# Altium schematic sheet PCB_28_pin_sch.SchDoc
size A2
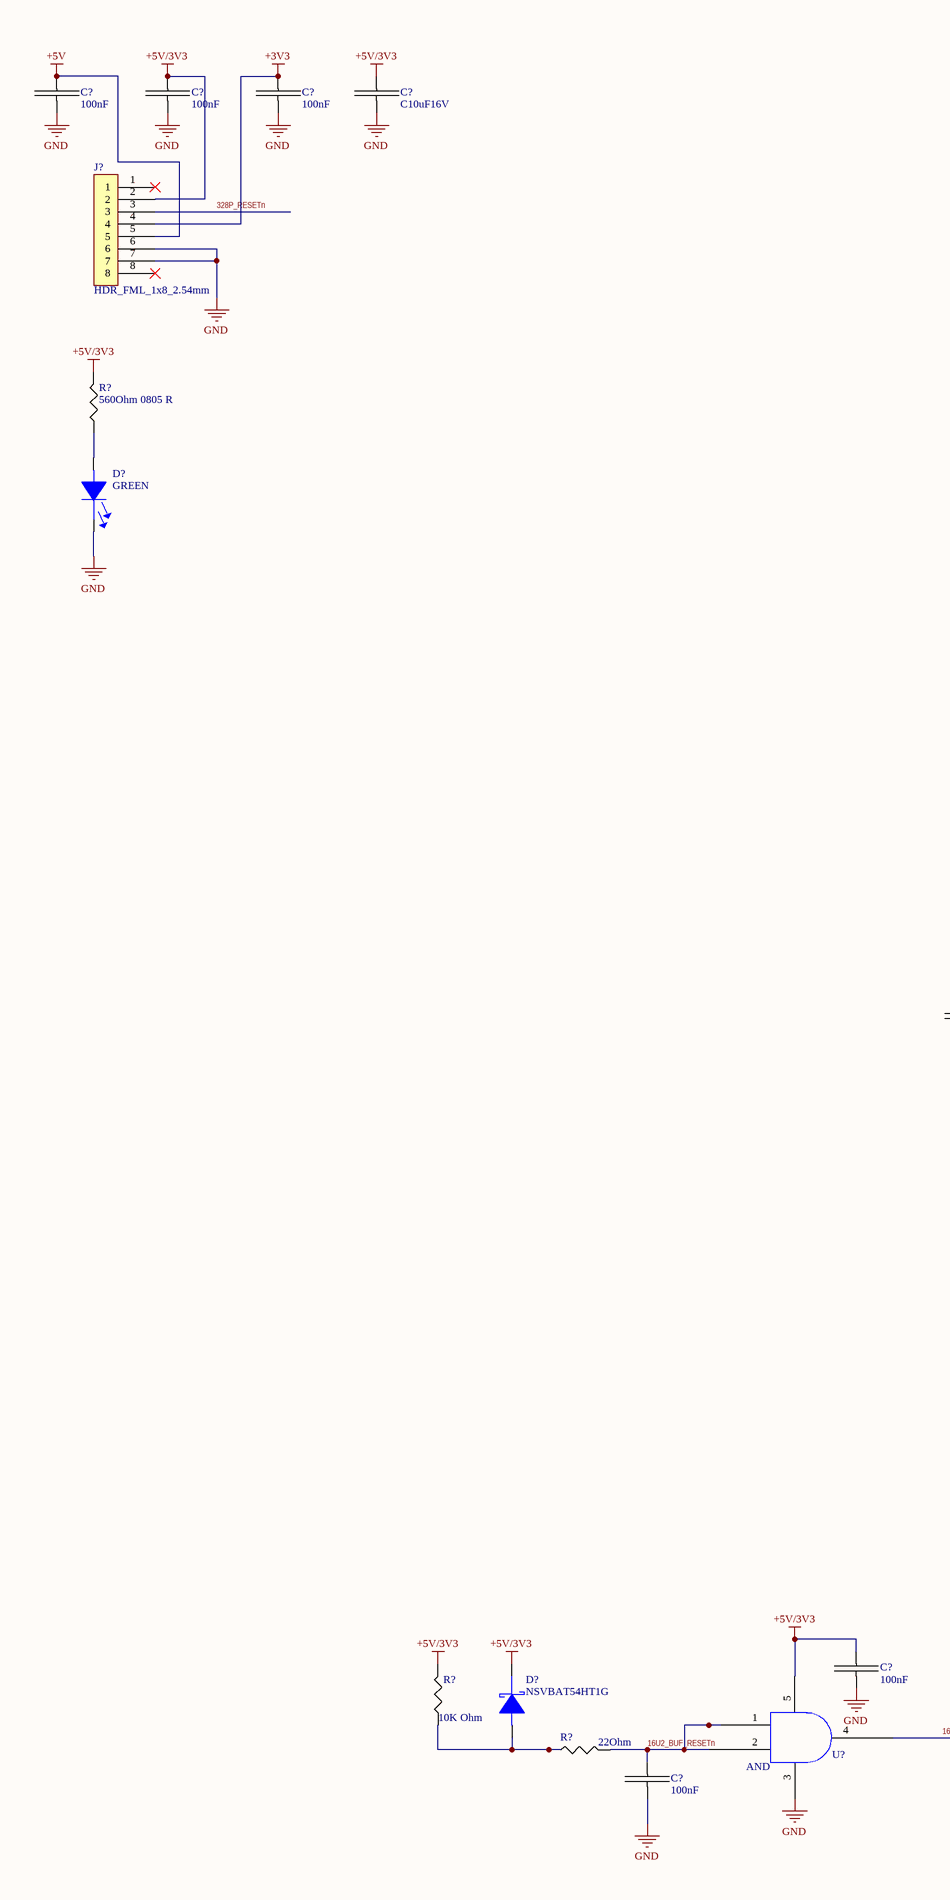
[diagram p0: PCB_28_pin_sch.SchDoc, left]
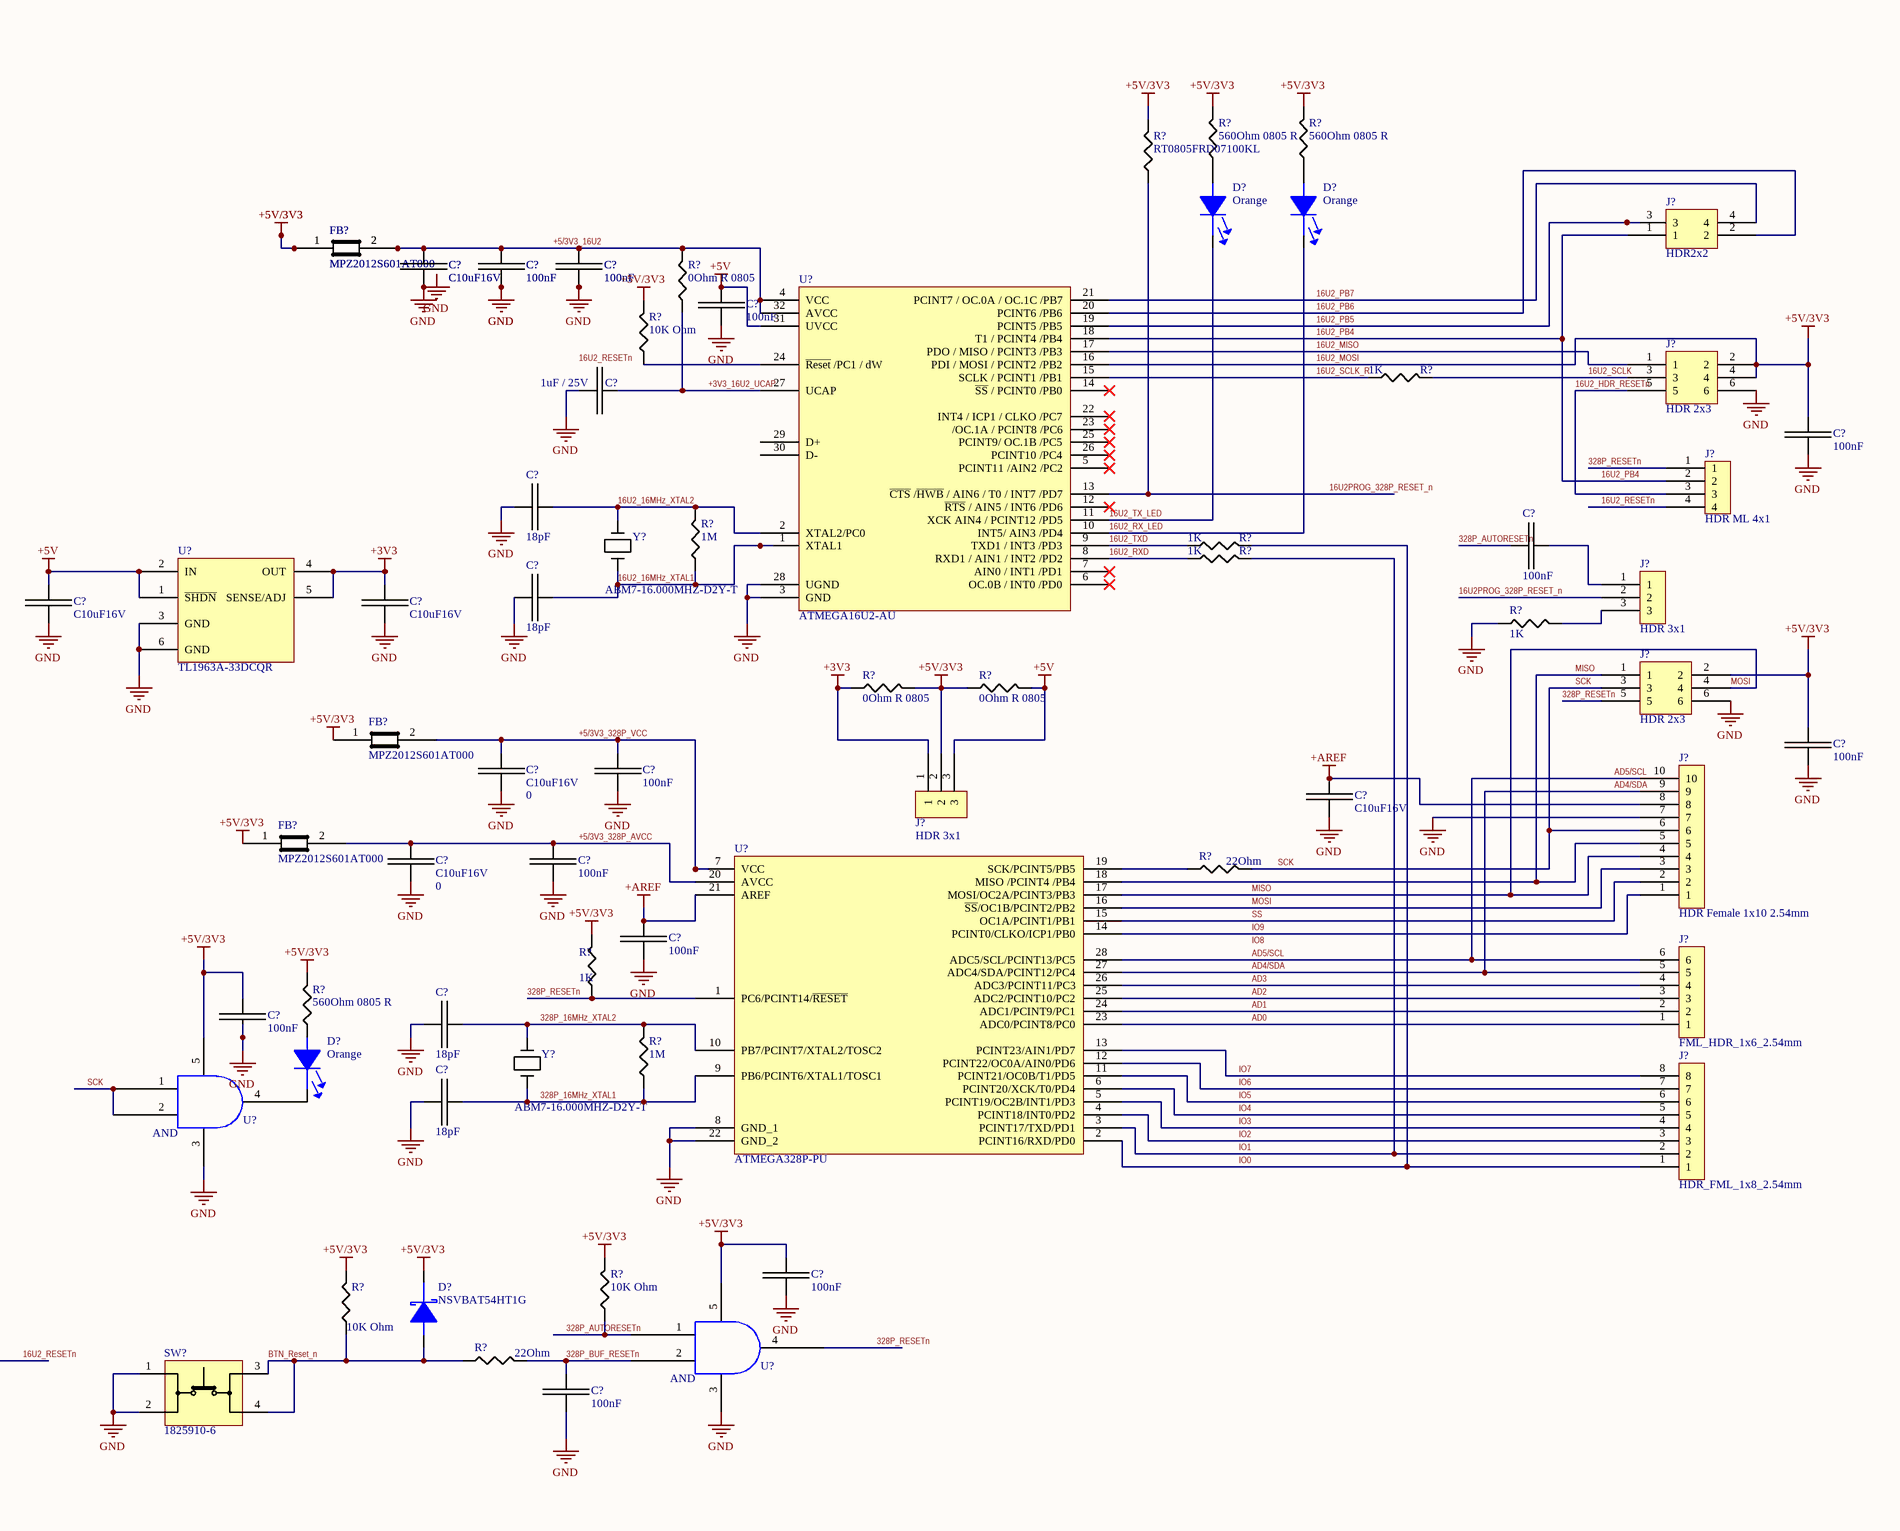
[diagram p1: PCB_28_pin_sch.SchDoc, right]

## Parts
(Parts that share a designator on the sheet are numbered #1, #2 ... from top to bottom, then left to right.)
C?#1  100nF  [C0805]
C?#2  100nF  [C0805]
C?#3  100nF  [C0805]
C?#4  C10uF16V  [C0805]
C?#5  C10uF16V  [C0805]
C?#6  C10uF16V  [C0805]
C?#7  100nF  [C0805]
C?#8  100nF  [C0805]
C?#9  100nF  [C0805]
C?#10  100nF  [C0805]
C?#11  100nF  [C0805]
C?#12  1uF / 25V  [C0805]
C?#13  100nF  [C0805]
C?#14  18pF  [C0805]
C?#15  100nF  [C0805]
C?#16  C10uF16V  [C0805]
C?#17  C10uF16V  [C0805]
C?#18  18pF  [C0805]
C?#19  100nF  [C0805]
C?#20  C10uF16V  Stock 1: 0  [C0805]
C?#21  100nF  [C0805]
C?#22  C10uF16V  [C0805]
C?#23  C10uF16V  Stock 1: 0  [C0805]
C?#24  100nF  [C0805]
C?#25  100nF  [C0805]
C?#26  100nF  [C0805]
C?#27  18pF  [C0805]
C?#28  18pF  [C0805]
C?#29  100nF  [C0805]
C?#30  100nF  [C0805]
C?#31  100nF  [C0805]
C?#32  100nF  [C0805]
D?#1  GREEN  [LED_0603]
D?#2  Orange  [LED_0603]
D?#3  Orange  [LED_0603]
D?#4  Orange  [LED_0603]
D?#5  NSVBAT54HT1G  [SOD323]
D?#6  NSVBAT54HT1G  [SOD323]
FB?#1  MPZ2012S601AT000  [C0805]
FB?#2  MPZ2012S601AT000  [C0805]
FB?#3  MPZ2012S601AT000  [C0805]
FB?#4  MPZ2012S601AT000  [C0805]
J?#1  HDR_FML_1x8_2.54mm  [HDR_FML_1x8_2.54mm]
J?#2  HDR2x2  [HDR2x22.54mm]
J?#3  HDR 2x3  [HDR2x32.54mm]
J?#4  HDR ML 4x1  [HDR_ML_1x4_2.54mm]
J?#5  HDR 3x1  [HDR_ML_1x3_2.54mm]
J?#6  HDR 2x3  [HDR2x32.54mm]
J?#7  HDR 3x1  [HDR_ML_1x3_2.54mm]
J?#8  HDR Female 1x10 2.54mm  [HDR_FML_1x10_2.54mm]
J?#9  FML_HDR_1x6_2.54mm  [HDR_FML_1x6_2.54mm]
J?#10  HDR_FML_1x8_2.54mm
R?#1  560Ohm 0805 R  [R0805]
R?#2  560Ohm 0805 R  [R0805]
R?#3  560Ohm 0805 R  [R0805]
R?#4  RT0805FRD07100KL  [R0805]
R?#5  0Ohm R 0805  [R0805]
R?#6  10K Ohm  [R0805]
R?#7  1K  [R0805]
R?#8  1M  [R0805]
R?#9  1K  [R0805]
R?#10  1K  [R0805]
R?#11  1K  [R0805]
R?#12  0Ohm R 0805  [R0805]
R?#13  0Ohm R 0805  [R0805]
R?#14  22Ohm  [R0805]
R?#15  1K  [R0805]
R?#16  560Ohm 0805 R  [R0805]
R?#17  1M  [R0805]
R?#18  10K Ohm  [R0805]
R?#19  10K Ohm  [R0805]
R?#20  10K Ohm  [R0805]
R?#21  22Ohm  [R0805]
R?#22  22Ohm  [R0805]
SW?  1825910-6  [1825910-6]
U?#1  ATMEGA16U2-AU  [TQFP32]
U?#2  TL1963A-33DCQR  [DCQ (R-PDSO-G6)]
U?#3  ATMEGA328P-PU  [DIP28_7.62]
U?#4  SN74AHC1G09DBVR  [DBV_SOP23_5]  (value not drawn)
U?#5  SN74AHC1G09DBVR  [DBV_SOP23_5]  (value not drawn)
U?#6  SN74AHC1G09DBVR  [DBV_SOP23_5]  (value not drawn)
Y?#1  ABM7-16.000MHZ-D2Y-T  [ABM7_v1_1_BIG]
Y?#2  ABM7-16.000MHZ-D2Y-T  [ABM7_v1_1_BIG]

## Nets
16U2_MOSI: C?#2.2 C?#4.2 C?#13.2 C?#19.2 C?#26.2 C?#29.2 C?#30.2 D?#5.1(Cathode) D?#6.1(Cathode) FB?#1.1 FB?#2.1 FB?#3.1 FB?#4.1 J?#1.2 J?#3.2 J?#3.4 J?#6.2 J?#7.2 R?#1.2 R?#2.2 R?#3.2 R?#4.2 R?#6.2 R?#12.2 R?#13.1 R?#15.2 R?#16.2 R?#18.2 R?#19.2 R?#20.2 U?#1.16(PDI_/_MOSI_/_PCINT2_/PB2) U?#4.5 U?#5.5 U?#6.5  [also labelled +5V/3V3]
+3V3: C?#3.2 C?#17.2 J?#1.4 J?#7.1 R?#12.1 U?#2.4(OUT) U?#2.5(SENSE/ADJ)
+5V: C?#1.2 C?#11.2 C?#16.2 J?#1.5 J?#7.3 R?#13.2 U?#1.31(UVCC) U?#2.1(~{SHDN}) U?#2.2(IN)
+AREF: C?#22.2 C?#25.2 J?#8.8 U?#3.21(AREF)
GND: C?#1.1 C?#2.1 C?#3.1 C?#4.1 C?#5.1 C?#6.1 C?#7.1 C?#8.1 C?#9.1 C?#10.1 C?#11.1 C?#12.1 C?#13.1 C?#14.1 C?#16.1 C?#17.1 C?#18.1 C?#19.1 C?#20.1 C?#21.1 C?#22.1 C?#23.1 C?#24.1 C?#25.1 C?#26.1 C?#27.1 C?#28.1 C?#29.1 C?#30.1 C?#31.1 C?#32.1 D?#1.1(Cathode) J?#1.6 J?#1.7 J?#3.6 J?#6.6 J?#8.7 R?#11.1 SW?.1 SW?.2 U?#1.3(GND) U?#1.28(UGND) U?#2.3(GND) U?#2.6(GND) U?#3.8(GND_1) U?#3.22(GND_2) U?#4.3 U?#5.3 U?#6.3
16U2_16MHz_XTAL1: C?#18.2 R?#8.1 U?#1.1(XTAL1) Y?#1.1
16U2_16MHz_XTAL2: C?#14.2 R?#8.2 U?#1.2(XTAL2/PC0) Y?#1.2
16U2_BUF_RESETn: C?#32.2 R?#22.2 U?#6.1 U?#6.2
16U2_HDR_RESETn: J?#3.5 J?#4.3
16U2_MISO: J?#3.1 U?#1.17(PDO_/_MISO_/_PCINT3_/PB3)
16U2_PB4: J?#2.1 J?#4.2 U?#1.18(T1_/_PCINT4_/PB4)
16U2_PB5: J?#2.3 U?#1.19(PCINT5_/PB5)
16U2_PB6: J?#2.2 U?#1.20(PCINT6_/PB6)
16U2_PB7: J?#2.4 U?#1.21(PCINT7_/_OC.0A_/_OC.1C_/PB7)
16U2_RESETn: J?#4.4 U?#6.4
16U2_RX_LED: D?#3.1(Cathode) U?#1.10(INT5/_AIN3_/PD4)
16U2_RXD: R?#10.1 U?#1.8(RXD1_/_AIN1_/_INT2_/PD2)
16U2_SCLK: J?#3.3 R?#7.2
16U2_SCLK_R: R?#7.1 U?#1.15(SCLK_/_PCINT1_/PB1)
16U2_TX_LED: D?#2.1(Cathode) U?#1.11(XCK_AIN4_/_PCINT12_/PD5)
16U2_TXD: R?#9.1 U?#1.9(TXD1_/_INT3_/PD3)
16U2PROG_328P_RESET_n: J?#5.2 R?#4.1 U?#1.13(~{CTS}_/~{HWB}_/_AIN6_/_T0_/_INT7_/PD7)
328P_16MHz_XTAL1: C?#28.2 R?#17.1 U?#3.9(PB6/PCINT6/XTAL1/TOSC1) Y?#2.1
328P_16MHz_XTAL2: C?#27.2 R?#17.2 U?#3.10(PB7/PCINT7/XTAL2/TOSC2) Y?#2.2
328P_AUTORESETn: C?#15.1 R?#18.1 U?#5.1
328P_BUF_RESETn: C?#31.2 R?#21.2 U?#5.2
328P_RESETn: J?#1.3 J?#4.1 J?#6.5 R?#15.1 U?#3.1(PC6/PCINT14/~{RESET}) U?#5.4
+3V3_16U2_UCAP: C?#12.2 R?#5.1 U?#1.27(UCAP)
+5/3V3_16U2: C?#5.2 C?#6.2 C?#7.2 C?#8.2 C?#9.2 C?#10.2 FB?#1.2 FB?#2.2 R?#5.2 U?#1.4(VCC) U?#1.32(AVCC)
+5/3V3_328P_AVCC: C?#23.2 C?#24.2 FB?#4.2 U?#3.20(AVCC)
+5/3V3_328P_VCC: C?#20.2 C?#21.2 FB?#3.2 U?#3.7(VCC)
AD0: J?#9.1 U?#3.23(ADC0/PCINT8/PC0)
AD1: J?#9.2 U?#3.24(ADC1/PCINT9/PC1)
AD2: J?#9.3 U?#3.25(ADC2/PCINT10/PC2)
AD3: J?#9.4 U?#3.26(ADC3/PCINT11/PC3)
AD4/SDA: J?#8.9 J?#9.5 U?#3.27(ADC4/SDA/PCINT12/PC4)
AD5/SCL: J?#8.10 J?#9.6 U?#3.28(ADC5/SCL/PCINT13/PC5)
BTN_Reset_n: D?#5.2(Anode) R?#19.1 R?#21.1 SW?.3 SW?.4
IO0: J?#10.1 R?#9.2 U?#3.2(PCINT16/RXD/PD0)
IO1: J?#10.2 R?#10.2 U?#3.3(PCINT17/TXD/PD1)
IO2: J?#10.3 U?#3.4(PCINT18/INT0/PD2)
IO3: J?#10.4 U?#3.5(PCINT19/OC2B/INT1/PD3)
IO4: J?#10.5 U?#3.6(PCINT20/XCK/T0/PD4)
IO5: J?#10.6 U?#3.11(PCINT21/OC0B/T1/PD5)
IO6: J?#10.7 U?#3.12(PCINT22/OC0A/AIN0/PD6)
IO7: J?#10.8 U?#3.13(PCINT23/AIN1/PD7)
IO9: J?#8.1 U?#3.14(PCINT0/CLKO/ICP1/PB0)
MISO: J?#6.1 J?#6.4 J?#8.3 J?#8.4 J?#8.5 U?#3.16(~{SS}/OC1B/PCINT2/PB2) U?#3.17(MOSI/OC2A/PCINT3/PB3) U?#3.18(MISO_/PCINT4_/PB4)  [also labelled MOSI]
SCK: J?#6.3 J?#8.6 R?#14.2 U?#4.1 U?#4.2
SS: J?#8.2 U?#3.15(OC1A/PCINT1/PB1)
NetC?#15_2: C?#15.2 J?#5.1
NetD?#1_2: D?#1.2(Anode) R?#1.1
NetD?#2_2: D?#2.2(Anode) R?#2.1
NetD?#3_2: D?#3.2(Anode) R?#3.1
NetD?#4_1: D?#4.1(Cathode) U?#4.4
NetD?#6_2: D?#6.2(Anode) R?#20.1 R?#22.1
NetJ?#5_3: J?#5.3 R?#11.2
NetR?#6_1: R?#6.1 U?#1.24(~{Reset}_/PC1_/_dW)
NetR?#14_1: R?#14.1 U?#3.19(SCK/PCINT5/PB5)

Not connected (* = marked no-connect by the designer): D?#4 2(Anode); J?#1 1* 8*; R?#16 1; U?#1 5(PCINT11_/AIN2_/PC2)* 6(OC.0B_/_INT0_/PD0)* 7(AIN0_/_INT1_/PD1)* 12(~{RTS}_/_AIN5_/_INT6_/PD6)* 14(~{SS}_/_PCINT0_/PB0)* 22(INT4_/_ICP1_/_CLKO_/PC7)* 23(/OC.1A_/_PCINT8_/PC6)* 25(PCINT9/_OC.1B_/PC5)* 26(PCINT10_/PC4)* 29(D+) 30(D-)

## Notes on the sheet
- Labels drawn without touching a wire or pin: 16U2_RESETn, GND, IO8
- (in symbol SN74AHC1G09DBVR) AND

## Library data of the parts
C?#1-C?#3 C?#7-C?#11 C?#13 C?#15 C?#19 C?#21 C?#24-C?#26 C?#29-C?#32 = C2012X7R1H104M085AA: CAP CER 0.1UF 50V X7R 0805; Manufacturer: TDK; PCN Part Number: MLCC Part Number Change 30/Nov/2012; Product Training Modules: C Series General Applications SEAT, CCV, and TVCL Design Tools Guide to Replacing an Electrolytic Capacitor with an MLCC; Capacitance: 0.1µF; Tolerance: ±20%; Online Catalog: C Series, General Purpose; Other Names: 445-7535-6; Supplier 1: Digi-Key; Manufacturer Part Number: C2012X7R1H104M085AA; Stock 1: 7928; Pricing 1: 1=0.15, 10=0.104, 50=0.059, 100=0.0488, 500=0.0342, 1000=0.0283 (USD); RoHS Information: RoHS Certificate-MLCC; Standard Package: 1; Category: Capacitors; Family: Ceramic Capacitors; Series: C; Packaging: Digi-Reel®; Voltage - Rated: 50V; Temperature Coefficient: X7R; Mounting Type: Surface Mount, MLCC; Operating Temperature: -55°C ~ 125°C; Applications: General Purpose; Ratings: -; Package / Case: 0805 (2012 Metric); Size / Dimension: 0.079" L x 0.049" W (2.00mm x 1.25mm); Height - Seated (Max): -; Thickness (Max): 0.037" (0.95mm); Lead Spacing: -; Features: -; Lead Style: -; ComponentLink1URL: https://product.tdk.com/info/en/catalog/datasheets/mlcc_commercial_general_en.pdf?src-supplier=Digi-Key; ComponentLink1Description: https://product.tdk.com/info/en/catalog/datasheets/mlcc_commercial_general_en.pdf?src-supplier=Digi-Key; ComponentLink2URL: https://product.tdk.com/info/en/catalog/spec/mlccspec_commercial_general_midvoltage_en.pdf?src-supplier=Digi-Key; ComponentLink2Description: https://product.tdk.com/info/en/catalog/spec/mlccspec_commercial_general_midvoltage_en.pdf?src-supplier=Digi-Key; Supplier Part Number 1: 445-7535-1-ND
C?#4-C?#6 C?#16 C?#17 C?#20 C?#22 C?#23 = C2012X5R1C106M125AC: CERAMIC CAPACITOR, 10UF, 16V, X5R, 20%, 0805, FULL REEL; Product Range:C Series; Capacitance:10 F; Capacitance Tolerance: 20%; Dielectric Characteristic:X5R; Voltage Rating:16V; Ceramic Capacitor Case:0805 [2012 Metric]; MSL:- ;RoHS Compliant: Yes; Manufacturer: TDK; PCN Part Number: MLCC Part Number Change 30/Nov/2012; Product Training Modules: C Series General Applications SEAT, CCV, and TVCL Design Tools Guide to Replacing an Electrolytic Capacitor with an MLCC; Catalog Drawings: C SERIES_2012-0805_1.45; Capacitance: 10µF; Online Catalog: C Series, General Purpose; Other Names: 445-4115-2 C2012X5R1C106M C2012X5R1C106M/1.25 C2012X5R1C106MT C2012X5R1C106MTJ00E; Supplier 1: Digi-Key; Manufacturer Part Number: C2012X5R1C106M125AC; RoHS Information: RoHS Certificate-MLCC; Standard Package: 2,000; Category: Capacitors; Family: Ceramic Capacitors; Series: C; Packaging: Tape & Reel (TR); Tolerance: ±20%; Voltage - Rated: 16V; Temperature Coefficient: X5R; Mounting Type: Surface Mount, MLCC; Operating Temperature: -55°C ~ 85°C; Applications: General Purpose; Ratings: -; Package / Case: 0805 (2012 Metric); Size / Dimension: 0.079" L x 0.049" W (2.00mm x 1.25mm); Height - Seated (Max): -; Thickness (Max): 0.057" (1.45mm); Lead Spacing: -; Features: -; Lead Style: -; ComponentLink1URL: https://media.digikey.com/pdf/Data%20Sheets/TDK%20PDFs/Multilayer%20Ceramic%20Chip%20Cap(up%20to%2050V).pdf?src-supplier=Digi-Key; ComponentLink1Description: https://media.digikey.com/pdf/Data%20Sheets/TDK%20PDFs/Multilayer%20Ceramic%20Chip%20Cap(up%20to%2050V).pdf?src-supplier=Digi-Key; ComponentLink2URL: http://www.farnell.com/datasheets/1913358.pdf?src-supplier=Element14; ComponentLink2Description: http://www.farnell.com/datasheets/1913358.pdf?src-supplier=Element14; ComponentLink3URL: https://product.tdk.com/info/en/documents/chara_sheet/C2012X5R1C106M125AC.pdf?src-supplier=Newark; ComponentLink3Description: https://product.tdk.com/info/en/documents/chara_sheet/C2012X5R1C106M125AC.pdf?src-supplier=Newark; Supplier Part Number 1: 445-4115-2-ND
C?#12 = C2012JB1E105M125AA: CAP CER 1UF 25V JB 0805; Manufacturer: TDK; Product Training Modules: C Series General Applications SEAT, CCV, and TVCL Design Tools Guide to Replacing an Electrolytic Capacitor with an MLCC; Featured Product: CH and JB Temperature Coefficient Capacitors; EDA / CAD Models: Download from Accelerated Designs; Capacitance: 1µF; Tolerance: ±20%; Online Catalog: C Series, General Purpose; Other Names: 445-11461-1; Supplier 1: Digi-Key; Manufacturer Part Number: C2012JB1E105M125AA; Stock 1: 1428; Pricing 1: 1=0.2, 10=0.139, 50=0.0836, 100=0.0706, 500=0.0483, 1000=0.0428 (USD); RoHS Information: RoHS Certificate-MLCC; Standard Package: 1; Category: Capacitors; Family: Ceramic Capacitors; Series: C; Packaging: Cut Tape (CT); Voltage - Rated: 25V; Temperature Coefficient: JB; Mounting Type: Surface Mount, MLCC; Operating Temperature: -25°C ~ 85°C; Applications: General Purpose; Package / Case: 0805 (2012 Metric); Size / Dimension: 0.079" L x 0.049" W (2.00mm x 1.25mm); Thickness (Max): 0.057" (1.45mm); ComponentLink1URL: https://product.tdk.com/en/products/common/pdf/mlcc_partnumber_description.pdf?src-supplier=Digi-Key; ComponentLink1Description: https://product.tdk.com/en/products/common/pdf/mlcc_partnumber_description.pdf?src-supplier=Digi-Key; Supplier Part Number 1: 445-11461-1-ND
C?#14 C?#18 C?#27 C?#28 = C0805C180J5GACTU: CAP CER 18PF 16V; Manufacturer: KEMET; Product Depth: 1.25 mm; Product Height: 0.78 mm; Product Length: 2 mm; Dielectric: C0G; Tolerance: 5 %; Voltage: 50 Vdc; Supplier 1: Digi-Key; Manufacturer Part Number: C0805C180J5GACTU; Stock 1: 98426; Pricing 1: 1=0.12, 10=0.086, 50=0.049, 100=0.0407, 500=0.0285, 1000=0.0236 (USD); Category: Capacitor Ceramic Multilayer; Construction: Flat; Operating Temperature: -55 to 125 °C; Capacitance Value: 18 pF; Mounting: Surface Mount; Package/Case: 0805; ComponentLink1URL: http://www.farnell.com/datasheets/1769375.pdf?src-supplier=Element14; ComponentLink1Description: http://www.farnell.com/datasheets/1769375.pdf?src-supplier=Element14; ComponentLink2URL: https://www.verical.com/server-webapp/html/getDatasheet?partID=385668&src-supplier=Verical; ComponentLink2Description: https://www.verical.com/server-webapp/html/getDatasheet?partID=385668&src-supplier=Verical; ComponentLink3URL: https://www.verical.com/server-webapp/html/getDatasheet?partID=759702&src-supplier=Verical; ComponentLink3Description: https://www.verical.com/server-webapp/html/getDatasheet?partID=759702&src-supplier=Verical; Supplier Part Number 1: 399-1112-1-ND
D?#1 = LGL29K-G2J1-24-Z: LED 0603 GREEN; Manufacturer: Osram Opto; Categories: Optoelectronics; Configuration: Standard; Lens Color: White; Lens Transparency: Diffused; Millicandela Rating: 3.92mcd; Lens Style: Rectangle with Flat Top; Lens Size: 1.30mm x 0.80mm; Voltage - Forward (Vf) (Typ): 1.7V; Current - Test: 2mA; Viewing Angle: 160°; Wavelength - Dominant: 570nm; Wavelength - Peak: 572nm; Supplier 1: Digi-Key; Manufacturer Part Number: LGL29K-G2J1-24-Z; Stock 1: 196415; Pricing 1: 1=0.47, 10=0.31, 100=0.2071, 500=0.1432, 1000=0.1194, 2000=0.1074 (USD); Series: SmartLED; Packaging: Digi-Reel®; Part Status: Active; Color: Green; Mounting Type: Surface Mount; Features: -; Package / Case: 0603 (1608 Metric); Supplier Device Package: 0603; Size / Dimension: 1.70mm L x 0.80mm W; Height (Max): 0.65mm; ComponentLink1URL: https://dammedia.osram.info/media/resource/hires/osram-dam-2493945/LG%20L29K.pdf?src-supplier=Digi-Key; ComponentLink1Description: https://dammedia.osram.info/media/resource/hires/osram-dam-2493945/LG%20L29K.pdf?src-supplier=Digi-Key; ComponentLink2URL: http://www.mouser.com/ds/2/311/LG%20L29K%20-%20SMARTLED%200603-335234.pdf?src-supplier=Mouser; ComponentLink2Description: http://www.mouser.com/ds/2/311/LG%20L29K%20-%20SMARTLED%200603-335234.pdf?src-supplier=Mouser; ComponentLink3URL: https://www.verical.com/server-webapp/html/getDatasheet?partID=571127&src-supplier=Verical; ComponentLink3Description: https://www.verical.com/server-webapp/html/getDatasheet?partID=571127&src-supplier=Verical; Supplier Part Number 1: 475-2709-1-ND
D?#2-D?#4 = LOL29K-H2K1-24-Z: SMARTLED 0603 ORANGE; Manufacturer: Osram Opto; Categories: Optoelectronics; Configuration: Standard; Lens Color: White; Lens Transparency: Diffused; Millicandela Rating: 6.3mcd; Lens Style: Rectangle with Flat Top; Lens Size: 1.30mm x 0.80mm; Voltage - Forward (Vf) (Typ): 1.8V; Current - Test: 2mA; Viewing Angle: 160°; Wavelength - Dominant: 606nm; Wavelength - Peak: 610nm; Supplier 1: Digi-Key; Manufacturer Part Number: LOL29K-H2K1-24-Z; Stock 1: 0; Series: SmartLED; Packaging: Digi-Reel®; Part Status: Active; Color: Orange; Mounting Type: Surface Mount; Features: -; Package / Case: 0603 (1608 Metric); Supplier Device Package: 0603; Size / Dimension: 1.70mm L x 0.80mm W; Height (Max): 0.65mm; ComponentLink1URL: https://dammedia.osram.info/media/resource/hires/osram-dam-2493882/LO%20L29K.pdf?src-supplier=Digi-Key; ComponentLink1Description: https://dammedia.osram.info/media/resource/hires/osram-dam-2493882/LO%20L29K.pdf?src-supplier=Digi-Key; ComponentLink2URL: https://www.verical.com/server-webapp/html/getDatasheet?partID=693885&src-supplier=Verical; ComponentLink2Description: https://www.verical.com/server-webapp/html/getDatasheet?partID=693885&src-supplier=Verical; Supplier Part Number 1: 475-2740-1-ND
D?#5 D?#6 = NSVBAT54HT1G: Schottky Diodes & Rectifiers SS SCHOTTKY DIODE; Manufacturer: ON Semiconductor; Voltage - DC Reverse (Vr) (Max): 30V; Current - Average Rectified (Io): 200mA (DC); Voltage - Forward (Vf) (Max) @ If: 800mV @ 100mA; Speed: Small Signal =; Reverse Recovery Time (trr): 5ns; Current - Reverse Leakage @ Vr: 2µA @ 25V; Capacitance @ Vr, F: 10pF @ 1V, 1MHz; Supplier 1: Digi-Key; Manufacturer Part Number: NSVBAT54HT1G; Stock 1: 5789; Pricing 1: 1=0.51, 10=0.362, 100=0.1826, 500=0.1618, 1000=0.1259 (USD); Standard Package: 3,000; Category: Discrete Semiconductor Products; Family: Diodes, Rectifiers - Single; Diode Type: Schottky; Mounting Type: Surface Mount; Package / Case: SC-76, SOD-323; Supplier Device Package: SOD-323; Packaging: Tape & Reel (TR); ComponentLink1URL: http://www.onsemi.com/pub/Collateral/BAT54HT1-D.PDF?src-supplier=Digi-Key; ComponentLink1Description: http://www.onsemi.com/pub/Collateral/BAT54HT1-D.PDF?src-supplier=Digi-Key; ComponentLink2URL: http://www.onsemi.com/pub_link/Collateral/BAT54HT1-D.PDF?src-supplier=Avnet+Europe; ComponentLink2Description: http://www.onsemi.com/pub_link/Collateral/BAT54HT1-D.PDF?src-supplier=Avnet+Europe; Supplier Part Number 1: NSVBAT54HT1GOSCT-ND
FB?#1-FB?#4 = MPZ2012S601AT000: FERRITE BEAD 600 OHM 0805 1LN; Manufacturer: TDK; PCN Part Number: MMZ,MPS Series Oct/2014; Product Training Modules: EMC Components; Catalog Drawings: (MMZ,MPZ)2012 Series Top / (MMZ,MPZ)2012 Series Footprint / (MMZ,MPZ)2012 Series Side; Impedance @ Frequency: 600 Ohm @ 100MHz; Current Rating: 2A; DC Resistance (DCR): 100 mOhm Max; Filter Type: Differential Mode - Single; Online Catalog: MPZ2012 Series; Other Names: 445-2206-6; Supplier 1: Digi-Key; Manufacturer Part Number: MPZ2012S601AT000; Stock 1: 215439; Pricing 1: 1=0.11, 10=0.092, 25=0.0824, 50=0.0604, 100=0.0522, 250=0.0412, 500=0.0348, 1000=0.0293 (USD); Standard Package: 1; Category: Filters; Family: Ferrite Beads and Chips; Series: MPZ; Packaging: Digi-Reel®; Package / Case: 0805 (2012 Metric); Mounting Type: Surface Mount; Height (Max): 0.041" (1.05mm); Size / Dimension: 0.079" L x 0.049" W (2.00mm x 1.25mm); ComponentLink1URL: https://media.digikey.com/pdf/Data%20Sheets/TDK%20PDFs/MPZ_Series_Br.pdf?src-supplier=Digi-Key; ComponentLink1Description: https://media.digikey.com/pdf/Data%20Sheets/TDK%20PDFs/MPZ_Series_Br.pdf?src-supplier=Digi-Key; ComponentLink2URL: https://product.tdk.com/info/en/catalog/datasheets/beads_commercial_power_mpz2012_en.pdf?src-supplier=Digi-Key; ComponentLink2Description: https://product.tdk.com/info/en/catalog/datasheets/beads_commercial_power_mpz2012_en.pdf?src-supplier=Digi-Key; Supplier Part Number 1: 445-2206-1-ND
J?#1 J?#10 = M20-7820842: 2.54mm (0.1") Pitch SIL Vertical PC Tail Socket Assembly, selective gold + tin, 8 contacts; Manufacturer: Harwin; Rad Hard: No; Number of Contacts: 8; Gender: SKT; Supplier 1: Digi-Key; Manufacturer Part Number: M20-7820842; Stock 1: 384; Pricing 1: 1=1.17, 10=1.03, 100=0.8888, 500=0.7272, 1000=0.6464, 5000=0.5656, 10000=0.5373 (USD); Type: Socket Strip; Pitch: 2.54 mm; Number of Rows: 1; Contact Plating: Gold; Termination Method: Solder; Category: Connector Headers and PCB Receptacles; ComponentLink1URL: https://cdn.harwin.com/pdfs/Harwin_PC_Connectors_M20.pdf?src-supplier=Avnet+Europe; ComponentLink1Description: https://cdn.harwin.com/pdfs/Harwin_PC_Connectors_M20.pdf?src-supplier=Avnet+Europe; ComponentLink2URL: http://www.harwin.com/include/downloads/drawings/M20-782.PDF?src-supplier=Avnet; ComponentLink2Description: http://www.harwin.com/include/downloads/drawings/M20-782.PDF?src-supplier=Avnet; Supplier Part Number 1: 952-1823-ND
J?#2 = 67996-404HLF: 67996-404HLF-BERG II 100CC DR ST ;ROHS COMPLIANT: YES; Manufacturer: Amphenol FCI; Pitch: 2.54 mm; Number of Contacts: 4; Gender: HDR; Supplier 1: Digi-Key; Manufacturer Part Number: 67996-404HLF; Stock 1: 2263; Pricing 1: 1=0.25, 10=0.235, 100=0.163, 500=0.1379, 1000=0.1129, 5000=0.1003, 10000=0.0909 (USD); Type: Unshrouded Header; Number of Rows: 2; Contact Plating: Tin Over Nickel; Termination Method: Solder; Category: Connector Headers and PCB Receptacles; ComponentLink1URL: https://cdn.amphenol-icc.com/media/wysiwyg/files/drawing/67996.pdf?src-supplier=Digi-Key; ComponentLink1Description: https://cdn.amphenol-icc.com/media/wysiwyg/files/drawing/67996.pdf?src-supplier=Digi-Key; ComponentLink2URL: http://portal.fciconnect.com/Comergent/fci/drawing/67996.pdf?src-supplier=Avnet; ComponentLink2Description: http://portal.fciconnect.com/Comergent/fci/drawing/67996.pdf?src-supplier=Avnet; ComponentLink3URL: http://portal.fciconnect.com/Comergent/fci/drawing/67996.pdf?src-supplier=Avnet+Europe; ComponentLink3Description: http://portal.fciconnect.com/Comergent/fci/drawing/67996.pdf?src-supplier=Avnet+Europe; Supplier Part Number 1: 609-3390-ND
J?#3 J?#6 = 68602-206HLF: AMPHENOL FCI   68602-206HLF   BOARD TO BOARD, HEADER, 6 POSITION, 2ROW; Pitch Spacing: 2.54mm; No. of Rows: 2; No. of Contacts: 6; Contact Termination: Through Hole Vertical; Supplier 1: Digi-Key; Manufacturer: Amphenol FCI; Manufacturer Part Number: 68602-206HLF; Stock 1: 3941; Pricing 1: 1=0.47, 10=0.442, 100=0.3386, 500=0.2944, 1000=0.2429, 5000=0.2134, 10000=0.1987 (USD); Series: BergStik; Gender: Header; Contact Plating: Gold; Contact Material: Phosphor Bronze; ComponentLink1URL: http://www.farnell.com/datasheets/1876884.pdf?src-supplier=Element14; ComponentLink1Description: http://www.farnell.com/datasheets/1876884.pdf?src-supplier=Element14; ComponentLink2URL: http://portal.fciconnect.com/Comergent//fci/drawing/67996.pdf?src-supplier=Digi-Key; ComponentLink2Description: http://portal.fciconnect.com/Comergent//fci/drawing/67996.pdf?src-supplier=Digi-Key; ComponentLink3URL: http://portal.fciconnect.com/Comergent/fci/drawing/67996.pdf?src-supplier=Avnet; ComponentLink3Description: http://portal.fciconnect.com/Comergent/fci/drawing/67996.pdf?src-supplier=Avnet
J?#4 = 61300411121: HEADER VERT 4POS 2.54MM; Manufacturer: Wurth Electronics; Connector Type: Header, Unshrouded; Number of Positions: 4; Number of Positions Loaded: All; Pitch: 0.100" (2.54mm); Supplier 1: Digi-Key; Manufacturer Part Number: 61300411121; Stock 1: 39006; Pricing 1: 1=0.18, 10=0.153, 25=0.1272, 50=0.106, 100=0.096, 1000=0.088 (USD); Category: Connectors, Interconnects; Family: Rectangular Connectors - Headers, Male Pins; Series: WR-PHD; Packaging: Bulk; Contact Type: Male Pin; Number of Rows: 1; Row Spacing: -; Contact Mating Length: 0.236" (6.00mm); Mounting Type: Through Hole; Termination: Solder; Fastening Type: -; Features: -; Contact Finish: Gold; Contact Finish Thickness: -; Color: Black; ComponentLink1URL: http://www.farnell.com/cad/1737268.pdf?src-supplier=Element14; ComponentLink1Description: http://www.farnell.com/cad/1737268.pdf?src-supplier=Element14; ComponentLink2URL: https://katalog.we-online.de/em/datasheet/6130xx11121.pdf?src-supplier=Digi-Key; ComponentLink2Description: https://katalog.we-online.de/em/datasheet/6130xx11121.pdf?src-supplier=Digi-Key; Supplier Part Number 1: 732-5317-ND
J?#5 J?#7 = 75160-150-03LF: HDR 3 POS 2.54mm Solder ST Thru-Hole Poly Bag; Manufacturer: Amphenol FCI; Number of Contacts: 3; Supplier 1: Digi-Key; Manufacturer Part Number: 75160-150-03LF; Stock 1: 471; Pricing 1: 1=0.61, 10=0.568, 100=0.4356, 500=0.3788, 1000=0.3125, 5000=0.2746, 10000=0.2557 (USD); Type: Unshrouded Header; Pitch: 2.54 mm; Number of Rows: 1; Gender: HDR; Contact Plating: Gold Over Nickel/ GXT Over Nickel; Termination Method: Solder; Category: Connector Headers and PCB Receptacles; ComponentLink1URL: http://portal.fciconnect.com/Comergent/fci/drawing/75160.pdf?src-supplier=Avnet; ComponentLink1Description: http://portal.fciconnect.com/Comergent/fci/drawing/75160.pdf?src-supplier=Avnet; ComponentLink2URL: http://portal.fciconnect.com/Comergent/fci/drawing/75160.pdf?src-supplier=Avnet+Europe; ComponentLink2Description: http://portal.fciconnect.com/Comergent/fci/drawing/75160.pdf?src-supplier=Avnet+Europe; Supplier Part Number 1: 609-75160-150-03LF-ND
J?#8 = M20-7821046: HARWIN - M20-7821046 - Board-To-Board Connector, M20 Series, Through Hole, Receptacle, 10, 2.54 mm, Tin Plated Contacts; Number of Contacts: 10; Body Orientation: Straight; Current Rating: 3A; Supplier 1: Digi-Key; Manufacturer: Harwin; Manufacturer Part Number: M20-7821046; Stock 1: 0; Pricing 1: 1=1.13, 10=0.997, 100=0.8602, 500=0.7038, 1000=0.6256, 5000=0.5474, 10000=0.52 (USD); Number of Rows: 1; Pitch: 2.54mm; Type: Socket Strip; Mounting Type: Through Hole; Termination Method: Solder; Contact Material: Phosphor Bronze; ComponentLink1URL: https://www.verical.com/server-webapp/html/getDatasheet?partID=559226&src-supplier=Verical; ComponentLink1Description: https://www.verical.com/server-webapp/html/getDatasheet?partID=559226&src-supplier=Verical; ComponentLink2URL: https://cdn.harwin.com/pdfs/M20-782.pdf?src-supplier=Digi-Key; ComponentLink2Description: https://cdn.harwin.com/pdfs/M20-782.pdf?src-supplier=Digi-Key; ComponentLink3URL: http://www.harwin.com/include/downloads/drawings/M20-782.PDF?src-supplier=Avnet; ComponentLink3Description: http://www.harwin.com/include/downloads/drawings/M20-782.PDF?src-supplier=Avnet; ComponentLink4URL: https://cdn.harwin.com/pdfs/Harwin_PC_Connectors_M20.pdf?src-supplier=Avnet+Europe; ComponentLink4Description: https://cdn.harwin.com/pdfs/Harwin_PC_Connectors_M20.pdf?src-supplier=Avnet+Europe; ComponentLink5URL: http://uk.rs-online.com/webdocs/1422/0900766b81422659.pdf?src-supplier=RSComponents; ComponentLink5Description: http://uk.rs-online.com/webdocs/1422/0900766b81422659.pdf?src-supplier=RSComponents; Supplier Part Number 1: 952-1847-ND
J?#9 = M20-7820646: 06-WAY SIL VERT SOCKET L/FREE; Manufacturer: Harwin; Rad Hard: No; Pitch: 2.54 mm; Number of Contacts: 6; Gender: SKT; Supplier 1: Digi-Key; Manufacturer Part Number: M20-7820646; Stock 1: 1754; Pricing 1: 1=1.01, 10=0.89, 100=0.7678, 500=0.6282, 1000=0.5584, 5000=0.4886, 10000=0.4642 (USD); Contact Plating: Tin; Type: Socket Strip; Number of Rows: 1; Termination Method: Solder; Category: Connector Headers and PCB Receptacles; ComponentLink1URL: http://www.harwin.com/include/downloads/pdfs/2010PAGE120.PDF?src-supplier=Avnet; ComponentLink1Description: http://www.harwin.com/include/downloads/pdfs/2010PAGE120.PDF?src-supplier=Avnet; ComponentLink2URL: https://cdn.harwin.com/pdfs/M20-782.pdf?src-supplier=Newark; ComponentLink2Description: https://cdn.harwin.com/pdfs/M20-782.pdf?src-supplier=Newark; ComponentLink3URL: https://cdn.harwin.com/pdfs/M20-782.pdf?src-supplier=Digi-Key; ComponentLink3Description: https://cdn.harwin.com/pdfs/M20-782.pdf?src-supplier=Digi-Key; ComponentLink4URL: http://components.arrow.com/part/dataview/0323_00725884?src-supplier=Arrow+Europe; ComponentLink4Description: http://components.arrow.com/part/dataview/0323_00725884?src-supplier=Arrow+Europe; ComponentLink5URL: https://cdn.harwin.com/pdfs/Harwin_PC_Connectors_M20.pdf?src-supplier=Avnet+Europe; ComponentLink5Description: https://cdn.harwin.com/pdfs/Harwin_PC_Connectors_M20.pdf?src-supplier=Avnet+Europe; ComponentLink6URL: https://cdn.harwin.com/pdfs/Harwin_PC_Connectors_M20.pdf?src-supplier=Mouser; ComponentLink6Description: https://cdn.harwin.com/pdfs/Harwin_PC_Connectors_M20.pdf?src-supplier=Mouser; ComponentLink7URL: https://cdn.harwin.com/pdfs/Harwin_PC_Connectors_M20.pdf?src-supplier=RSComponents; ComponentLink7Description: https://cdn.harwin.com/pdfs/Harwin_PC_Connectors_M20.pdf?src-supplier=RSComponents; ComponentLink8URL: https://cdn.harwin.com/pdfs/M20-782.pdf?src-supplier=Farnell; ComponentLink8Description: https://cdn.harwin.com/pdfs/M20-782.pdf?src-supplier=Farnell; ComponentLink9URL: https://cdn.harwin.com/pdfs/Harwin_PC_Connectors_M20.pdf?src-supplier=TTI; ComponentLink9Description: https://cdn.harwin.com/pdfs/Harwin_PC_Connectors_M20.pdf?src-supplier=TTI; Supplier Part Number 1: 952-1809-ND
R?#1-R?#3 R?#16 = RC0805FR-07560RL: Manufacturer: Yageo; Resistance: 560 Ohms; Tolerance: 1 %; Power Rating: 125 mW (1/8 W); Temperature Coefficient: 100 PPM / C; Voltage Rating: 150 V; Unit Weight: 0.000194 oz; Supplier 1: Digi-Key; Manufacturer Part Number: RC0805FR-07560RL; Stock 1: 129053; Pricing 1: 1=0.1, 10=0.04, 100=0.0162, 1000=0.0073, 2500=0.0063 (USD); Product Category: Thick Film Resistors; RoHS: True; Brand: Yageo; Case Code - in: 0805; Case Code - mm: 2012; Operating Temperature Range: - 55 C to + 155 C; Series: RC; Height: 0.5 mm; Length: 2 mm; Package / Case: 0805 (2012 metric); Packaging: Reel; Product: Thick Film Resistors General Purpose; Termination Style: SMD/SMT; Type: General Purpose Chip Resistor Surface Mount; Width: 1.25 mm; ComponentLink1URL: http://www.yageo.com/documents/recent/PYu-RC_Group_51_RoHS_L_10.pdf?src-supplier=Digi-Key; ComponentLink1Description: http://www.yageo.com/documents/recent/PYu-RC_Group_51_RoHS_L_10.pdf?src-supplier=Digi-Key; ComponentLink2URL: http://www.yageo.com/documents/recent/PYu-RC_Group_51_RoHS_L_9.pdf?src-supplier=Mouser; ComponentLink2Description: http://www.yageo.com/documents/recent/PYu-RC_Group_51_RoHS_L_9.pdf?src-supplier=Mouser; ComponentLink3URL: http://www.farnell.com/datasheets/2167052.pdf?src-supplier=Element14; ComponentLink3Description: http://www.farnell.com/datasheets/2167052.pdf?src-supplier=Element14; Supplier Part Number 1: 311-560CRDKR-ND
R?#4 = RT0805FRD07100KL: RES SMD 100K OHM 1% 1/8W 0805; Manufacturer: Yageo; Power (Watts): 0.125W, 1/8W; Temperature Coefficient: ±25ppm/°C; Supplier 1: Digi-Key; Manufacturer Part Number: RT0805FRD07100KL; Stock 1: 4170; Pricing 1: 1=0.13, 10=0.116, 100=0.0448, 1000=0.0197, 2500=0.017 (USD); Category: Resistors; Family: Chip Resistor - Surface Mount; Series: RT; Packaging: Tape & Reel (TR); Resistance (Ohms): 100k; Tolerance: ±1%; Composition: Thin Film; Features: Moisture Resistant; Operating Temperature: -55°C ~ 155°C; Package / Case: 0805 (2012 Metric); Supplier Device Package: 0805; Size / Dimension: 0.079" L x 0.049" W (2.00mm x 1.25mm); Height: 0.024" (0.60mm); Number of Terminations: 2; ComponentLink1URL: http://www.yageo.com/documents/recent/PYu-RT_1-to-0.01_RoHS_L_8.pdf?src-supplier=Digi-Key; ComponentLink1Description: http://www.yageo.com/documents/recent/PYu-RT_1-to-0.01_RoHS_L_8.pdf?src-supplier=Digi-Key; Supplier Part Number 1: 13-RT0805FRD07100KLCT-ND
R?#5 R?#12 R?#13 = CR0805AJ/-000EAS: Res Anti-Sulfured Jumper Thick Film 0805 0 Ohm 1/8W Molded Paper T/R; Manufacturer: Bourns; Supplier 1: Digi-Key; Manufacturer Part Number: CR0805AJ/-000EAS; Stock 1: 1213; Pricing 1: 1=0.1, 10=0.064, 100=0.026, 1000=0.0117, 2500=0.0101 (USD); Supplier Part Number 1: CR0805AJ/-000EASDKR-ND
R?#6 R?#18-R?#20 = RT0805FRE0710KL: RES SMD 10K Ohm 0805; Manufacturer: Yageo; Altezza custodia: 0.5 mm; Case Length: 2 mm; Case Width: 1.25 mm; Coefficiente di temperatura: 50 PPM / C; Confezione: Reel; Resistenza: 10 kOhms; Package/involucro: 0805 (2012 metric); Potenza nominale: 125 mW (1/8 W); Serie: RT; Range di temperatura di lavoro: - 55 C to + 125 C; Stile di terminazione: SMD/SMT; Prodotto: Thin Film Resistors SMD; Tolleranza: 1 %; Tensione nominale: 150 V; Supplier 1: Digi-Key; Manufacturer Part Number: RT0805FRE0710KL; Stock 1: 9199; Pricing 1: 1=0.1, 10=0.08, 100=0.031, 1000=0.0136, 2500=0.0118 (USD); Case Code - in: 0805; Case Code - mm: 2012; Case Height: 0.5 mm; Dimensioni: 1.25 mm W x 2 mm L x 0.5 mm H; Lunghezza custodia: 2 mm; Larghezza custodia: 1.25 mm; Dimensions: 1.25 mm W x 2 mm L x 0.5 mm H; Operating Temperature Range: - 55 C to + 125 C; Produttore: Yageo; RoHS:: Dettagli; RoHS: Details; Resistance: 10 kOhms; Power Rating: 125 mW (1/8 W); Package / Case: 0805 (2012 metric); Packaging: Reel; Product: Thin Film Resistors SMD; Series: RT; Termination Style: SMD/SMT; Tolerance: 1 %; Temperature Coefficient: 50 PPM / C; Voltage Rating: 150 V; Type: High Precision, High Stability; ComponentLink1URL: http://www.farnell.com/datasheets/2167391.pdf?src-supplier=Element14; ComponentLink1Description: http://www.farnell.com/datasheets/2167391.pdf?src-supplier=Element14; ComponentLink2URL: http://www.mouser.com/ds/2/447/yageodocoutput-1125656.pdf?src-supplier=Mouser; ComponentLink2Description: http://www.mouser.com/ds/2/447/yageodocoutput-1125656.pdf?src-supplier=Mouser; ComponentLink3URL: http://www.yageo.com/documents/recent/PYu-RT_1-to-0.01_RoHS_L_9.pdf?src-supplier=Digi-Key; ComponentLink3Description: http://www.yageo.com/documents/recent/PYu-RT_1-to-0.01_RoHS_L_9.pdf?src-supplier=Digi-Key; Supplier Part Number 1: YAG1239CT-ND
R?#7 R?#9-R?#11 R?#15 = RT0805FRE071KL: RES SMD 1K OHM 1% 1/8W 0805; Manufacturer: Yageo; Altezza custodia: 0.5 mm; Case Length: 2 mm; Case Width: 1.25 mm; Coefficiente di temperatura: 50 PPM / C; Confezione: Reel; Resistenza: 1 kOhms; Package/involucro: 0805 (2012 metric); Potenza nominale: 125 mW (1/8 W); Serie: RT; Range di temperatura di lavoro: - 55 C to + 125 C; Stile di terminazione: SMD/SMT; Prodotto: Thin Film Resistors SMD; Tensione nominale: 150 V; Supplier 1: Digi-Key; Manufacturer Part Number: RT0805FRE071KL; Stock 1: 29016; Pricing 1: 1=0.1, 10=0.08, 100=0.031, 1000=0.0136, 2500=0.0118 (USD); Case Code - in: 0805; Case Code - mm: 2012; Case Height: 0.5 mm; Dimensioni: 1.25 mm W x 2 mm L x 0.5 mm H; Lunghezza custodia: 2 mm; Larghezza custodia: 1.25 mm; Dimensions: 1.25 mm W x 2 mm L x 0.5 mm H; Operating Temperature Range: - 55 C to + 125 C; Produttore: Yageo; RoHS:: Dettagli; RoHS: Details; Resistance: 1 kOhms; Power Rating: 125 mW (1/8 W); Package / Case: 0805 (2012 metric); Packaging: Reel; Product: Thin Film Resistors SMD; Series: RT; Tolleranza: 1 %; Termination Style: SMD/SMT; Tolerance: 1 %; Temperature Coefficient: 50 PPM / C; Voltage Rating: 150 V; Type: High Precision, High Stability; ComponentLink1URL: http://www.farnell.com/datasheets/2167391.pdf?src-supplier=Element14; ComponentLink1Description: http://www.farnell.com/datasheets/2167391.pdf?src-supplier=Element14; ComponentLink2URL: http://www.mouser.com/ds/2/447/yageodocoutput-1125656.pdf?src-supplier=Mouser; ComponentLink2Description: http://www.mouser.com/ds/2/447/yageodocoutput-1125656.pdf?src-supplier=Mouser; ComponentLink3URL: http://www.yageo.com/documents/recent/PYu-RT_1-to-0.01_RoHS_L_9.pdf?src-supplier=Digi-Key; ComponentLink3Description: http://www.yageo.com/documents/recent/PYu-RT_1-to-0.01_RoHS_L_9.pdf?src-supplier=Digi-Key; Supplier Part Number 1: YAG1240CT-ND
R?#8 R?#17 = RC0805FR-071ML: RES SMD 1M OHM 1% 1/8W 0805; Manufacturer: Yageo; Resistance: 1 MOhms; Power Rating: 125 mW (1/8 W); Voltage Rating: 150 V; Temperature Coefficient: 100 PPM / C; Supplier 1: Digi-Key; Manufacturer Part Number: RC0805FR-071ML; Stock 1: 2428288; Pricing 1: 1=0.1, 10=0.036, 100=0.0147, 1000=0.0066, 2500=0.0057 (USD); Termination Style: SMD/SMT; Product: Thick Film Resistors General Purpose; Tolerance: 1 %; Case Code - in: 0805; Case Code - mm: 2012; Series: RC; Operating Temperature Range: - 55 C to + 155 C; Packaging: Reel; ComponentLink1URL: http://www.yageo.com/documents/recent/PYu-RC_Group_51_RoHS_L_10.pdf?src-supplier=Digi-Key; ComponentLink1Description: http://www.yageo.com/documents/recent/PYu-RC_Group_51_RoHS_L_10.pdf?src-supplier=Digi-Key; ComponentLink2URL: http://www.yageo.ru/pdf/RC0805.pdf?src-supplier=Future+Electronics; ComponentLink2Description: http://www.yageo.ru/pdf/RC0805.pdf?src-supplier=Future+Electronics; ComponentLink3URL: http://www.yageo.com/documents/recent/PYu-RC_Group_51_RoHS_L_9.pdf?src-supplier=Mouser; ComponentLink3Description: http://www.yageo.com/documents/recent/PYu-RC_Group_51_RoHS_L_9.pdf?src-supplier=Mouser; Supplier Part Number 1: 311-1.00MCRCT-ND
R?#14 R?#21 R?#22 = RC0805FR-0722RL: RES SMD 22 OHM 1% 1/8W 0805; Manufacturer: Yageo; Resistance: 22 Ohms; Power Rating: 125 mW (1/8 W); Voltage Rating: 150 V; Temperature Coefficient: 100 PPM / C; Supplier 1: Digi-Key; Manufacturer Part Number: RC0805FR-0722RL; Stock 1: 210000; Pricing 1: 5000=0.0052, 10000=0.0045, 25000=0.004, 50000=0.0036, 125000=0.0036 (USD); Termination Style: SMD/SMT; Product: Thick Film Resistors General Purpose; Tolerance: 1 %; Case Code - in: 0805; Case Code - mm: 2012; Series: RC; Operating Temperature Range: - 55 C to + 155 C; Packaging: Reel; ComponentLink1URL: http://www.farnell.com/datasheets/444164.pdf?src-supplier=Element14; ComponentLink1Description: http://www.farnell.com/datasheets/444164.pdf?src-supplier=Element14; ComponentLink2URL: http://www.yageo.com/documents/recent/PYu-RC_Group_51_RoHS_L_10.pdf?src-supplier=Digi-Key; ComponentLink2Description: http://www.yageo.com/documents/recent/PYu-RC_Group_51_RoHS_L_10.pdf?src-supplier=Digi-Key; ComponentLink3URL: http://www.yageo.com/documents/recent/PYu-RC_Group_51_RoHS_L_9.pdf?src-supplier=Mouser; ComponentLink3Description: http://www.yageo.com/documents/recent/PYu-RC_Group_51_RoHS_L_9.pdf?src-supplier=Mouser
SW? = 2-1825910-8: Switch Tactile OFF (ON) SPST Round Button PC Pins 0.05A 24VDC 100000Cycles 2.55N Thru-Hole Loose; Manufacturer: TE Connectivity; Other Names: FSM14JAH / FSM14JAH-ND; Mechanical Life: 100,000 Cycles; Switch Travel: 0.25mm; Actuator Material: Polyamide (PA66), Nylon 6/6; Operating Force: 260gf; Illumination: Non-Illuminated; Outline: 6.00mm x 6.00mm; Actuator Orientation: Top Actuated; Actuator Height off PCB, from Pins: 13.00mm; Actuator Type: Standard; Contact Rating @ Voltage: 0.05A @ 24VDC; Switch Function: Off-Mom; Circuit: SPST-NO; 3D Model: 2-1825910-8.pdf; Supplier 1: Digi-Key; Manufacturer Part Number: 2-1825910-8; Stock 1: 3134; Pricing 1: 1=0.17, 10=0.163, 25=0.1544, 100=0.1405, 250=0.1321, 500=0.1209, 1000=0.1012, 2500=0.0984, 5000=0.0928 (USD); Operating Temperature: -35°C ~ 85°C; Termination Style: PC Pin; Mounting Type: Through Hole; Packaging: Bulk; Series: FSMJ, Alcoswitch; Family: Tactile Switches; Category: Switches; Standard Package: 30,000; RoHS Information: 2-1825910-8 Statement of Compliance; ComponentLink1URL: http://www.te.com/commerce/DocumentDelivery/DDEController?Action=srchrtrv&DocNm=1825910&DocType=Customer+Drawing&DocLang=English&src-supplier=Digi-Key; ComponentLink1Description: http://www.te.com/commerce/DocumentDelivery/DDEController?Action=srchrtrv&DocNm=1825910&DocType=Customer+Drawing&DocLang=English&src-supplier=Digi-Key
U?#1 = ATMEGA16U2-AU: ATmega Series 16 KB Flash 512 B RAM 16 MHz 8-Bit Microcontroller - TQFP-32; Manufacturer: Microchip; Categories: Integrated Circuits (ICs); Core Processor: AVR; Speed: 16MHz; Connectivity: SPI, UART/USART, USB; Peripherals: Brown-out Detect/Reset, POR, PWM, WDT; Number of I/O: 22; Program Memory Size: 16KB (8K x 16); EEPROM Size: 512 x 8; Voltage - Supply (Vcc/Vdd): 2.7V ~ 5.5V; Oscillator Type: Internal; Supplier 1: Digi-Key; Manufacturer Part Number: ATMEGA16U2-AU; Stock 1: 865; Pricing 1: 1=2.45, 25=2.25, 100=2.04 (USD); Series: AVR® ATmega; Packaging: Tray; Part Status: Active; Core Size: 8-Bit; Program Memory Type: FLASH; RAM Size: 512 x 8; Data Converters: -; Operating Temperature: -40°C ~ 85°C (TA); Package / Case: 32-TQFP; Supplier Device Package: 32-TQFP (7x7); Base Part Number: ATMEGA16U2; Supplier Part Number 1: ATMEGA16U2-AU-ND
U?#2 = TL1963A-33DCQR: IC REG LINEAR 3.3V 1.5A SOT223-6; Manufacturer: Texas Instruments; Voltage Regulator Type: LDO; Regulator Output Type: Fixed; Polarity Type: Positive; Number of Outputs: 1; Input Voltage (Min): 1.9V; Input Voltage: 20V; Load Regulation: 20mV; Line Regulation: 10mV; Supplier 1: Digi-Key; Manufacturer Part Number: TL1963A-33DCQR; Stock 1: 1769; Pricing 1: 1=2.97, 10=2.664, 25=2.5184, 100=2.0708, 250=1.8581, 500=1.791, 1000=1.4888 (USD); Topology: LDO; Output Voltage: 3.3V; Package Type: SOT-223; Packaging: Tape and Reel; Output Current: 1.5A; Operating Temp Range: -40C to 125C; Operating Temperature Classification: Automotive; Pin Count: 5 +Tab; Mounting: Surface Mount; ComponentLink1URL: http://www.ti.com/lit/ds/symlink/tl1963a.pdf?src-supplier=Digi-Key; ComponentLink1Description: http://www.ti.com/lit/ds/symlink/tl1963a.pdf?src-supplier=Digi-Key; ComponentLink2URL: http://www.ti.com/lit/ds/symlink/tl1963a.pdf?src-supplier=Avnet+Europe; ComponentLink2Description: http://www.ti.com/lit/ds/symlink/tl1963a.pdf?src-supplier=Avnet+Europe; Supplier Part Number 1: 296-24534-1-ND
U?#3 = ATMEGA328P-PU: ATMEGA328P-PU; 8 bit Microcontroller AVR 20MHz 1; 32kb Flash; 2kb RAM; I2C SPI 2; Manufacturer: Microchip; Supplier 1: Digi-Key; Manufacturer Part Number: ATMEGA328P-PU; Stock 1: 5066; Pricing 1: 1=2.08, 25=1.91, 100=1.73 (USD); Supplier Part Number 1: ATMEGA328P-PU-ND
U?#4-U?#6 = SN74AHC1G09DBVR: TEXAS INSTRUMENTS - SN74AHC1G09DBVR - AND Gate, 74AHC1G09, 2 Input, 2 V to 5.5 V, SOT-23-5; Number of Circuits: 1; Number of Inputs: 2; Voltage - Supply: 2 V ~ 5.5 V; Current - Quiescent (Max): 1µA; Current - Output High, Low: -, 8mA; Logic Level - Low: 0.5 V ~ 1.65 V; Logic Level - High: 1.5 V ~ 3.85 V; Max Propagation Delay @ V, Max CL: 7.5ns @ 5V, 50pF; Dynamic Catalog: 74AHC; Other Names: 296-29202-6; Supplier 1: Digi-Key; Manufacturer: Texas Instruments; Manufacturer Part Number: SN74AHC1G09DBVR; Stock 1: 17195; Pricing 1: 1=0.36, 10=0.271, 25=0.2376, 100=0.1537, 250=0.1272, 500=0.1018, 1000=0.078 (USD); Standard Package: 1; Category: Integrated Circuits (ICs); Family: Logic - Gates and Inverters; Series: 74AHC; Logic Type: AND Gate; Features: Open Drain; Operating Temperature: -55°C ~ 125°C; Mounting Type: Surface Mount; Supplier Device Package: SOT-23-5; Package / Case: SC-74A, SOT-753; Packaging: Digi-Reel®; ComponentLink1URL: http://www.ti.com/lit/ds/symlink/sn74ahc1g09.pdf?src-supplier=Digi-Key; ComponentLink1Description: http://www.ti.com/lit/ds/symlink/sn74ahc1g09.pdf?src-supplier=Digi-Key; Supplier Part Number 1: 296-29202-1-ND
Y?#1 Y?#2 = ABM7-16.000MHZ-D2Y-T: CRYSTAL 16.0000MHZ 18PF SMD; Manufacturer: Abracon; Catalog Drawings: ABM7 Series Top / ABM7 Series Side / ABM7 Series Bottom; Featured Product: ABM7 and ABM11 Crystals; 3D Model: ABM7.pdf / ABM7.stp; Frequency: 16MHz; Frequency Stability: ±30ppm; Frequency Tolerance: ±20ppm; ESR (Equivalent Series Resistance): 50 Ohm; Operating Mode: Fundamental; Online Catalog: ABM7 Series; Other Names: 535-9840-2 / ABM7-16.000MHZ-D-2-Y-T / ABM716000MHZD2YT; Supplier 1: Digi-Key; Manufacturer Part Number: ABM7-16.000MHZ-D2Y-T; Stock 1: 54086; Pricing 1: 1=0.87, 10=0.773, 50=0.7224, 100=0.6384, 500=0.6048 (USD); RoHS Information: RoHS2/REACH Compliance; Standard Package: 1,000; Category: Crystals and Oscillators; Family: Crystals; Series: ABM7; Packaging: Tape & Reel (TR); Type: MHz Crystal; Load Capacitance: 18pF; Operating Temperature: -40°C ~ 85°C; Mounting Type: Surface Mount; Package / Case: 2-SMD; Size / Dimension: 0.236" L x 0.138" W (6.00mm x 3.50mm); Height: 0.055" (1.40mm); ComponentLink1URL: https://www.verical.com/server-webapp/html/getDatasheet?partID=721624&src-supplier=Verical; ComponentLink1Description: https://www.verical.com/server-webapp/html/getDatasheet?partID=721624&src-supplier=Verical; ComponentLink2URL: http://www.farnell.com/datasheets/947971.pdf?src-supplier=Element14; ComponentLink2Description: http://www.farnell.com/datasheets/947971.pdf?src-supplier=Element14; ComponentLink3URL: http://www.abracon.com/Resonators/abm7.pdf?src-supplier=Farnell; ComponentLink3Description: http://www.abracon.com/Resonators/abm7.pdf?src-supplier=Farnell; ComponentLink4URL: http://www.abracon.com/Resonators/abm7.pdf?src-supplier=Future+Electronics; ComponentLink4Description: http://www.abracon.com/Resonators/abm7.pdf?src-supplier=Future+Electronics; ComponentLink5URL: https://abracon.com/Resonators/abm7.pdf?src-supplier=Digi-Key; ComponentLink5Description: https://abracon.com/Resonators/abm7.pdf?src-supplier=Digi-Key; ComponentLink6URL: http://www.abracon.com/Support/PackageDrawing/Resonators/ABM7.PDF?src-supplier=Verical; ComponentLink6Description: http://www.abracon.com/Support/PackageDrawing/Resonators/ABM7.PDF?src-supplier=Verical; Supplier Part Number 1: 535-9840-1-ND